# Altium schematic sheet master_sheet.SchDoc
size A4
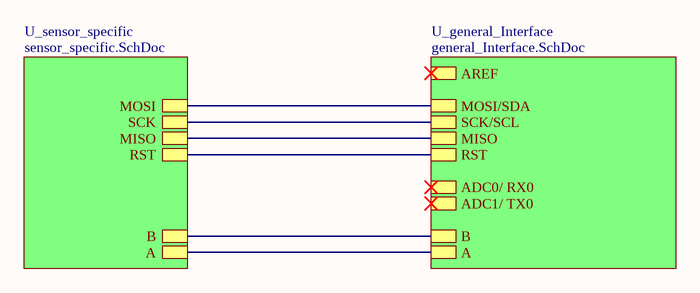
[diagram p0: master_sheet.SchDoc]

## Sub-sheets
U_general_Interface = general_Interface.SchDoc: AREF, MOSI/SDA, SCK/SCL, MISO, RST, ADC0/ RX0, ADC1/ TX0, B, A
U_sensor_specific = sensor_specific.SchDoc: MOSI, SCK, MISO, RST, B, A

## Nets
(unnamed): sheet U_sensor_specific/MOSI, sheet U_general_Interface/MOSI/SDA
(unnamed): sheet U_sensor_specific/SCK, sheet U_general_Interface/SCK/SCL
(unnamed): sheet U_sensor_specific/MISO, sheet U_general_Interface/MISO
(unnamed): sheet U_sensor_specific/RST, sheet U_general_Interface/RST
(unnamed): sheet U_sensor_specific/B, sheet U_general_Interface/B
(unnamed): sheet U_sensor_specific/A, sheet U_general_Interface/A